# EAGLE design Custom_Teensy_3.1 (EAGLE 7.6.0)
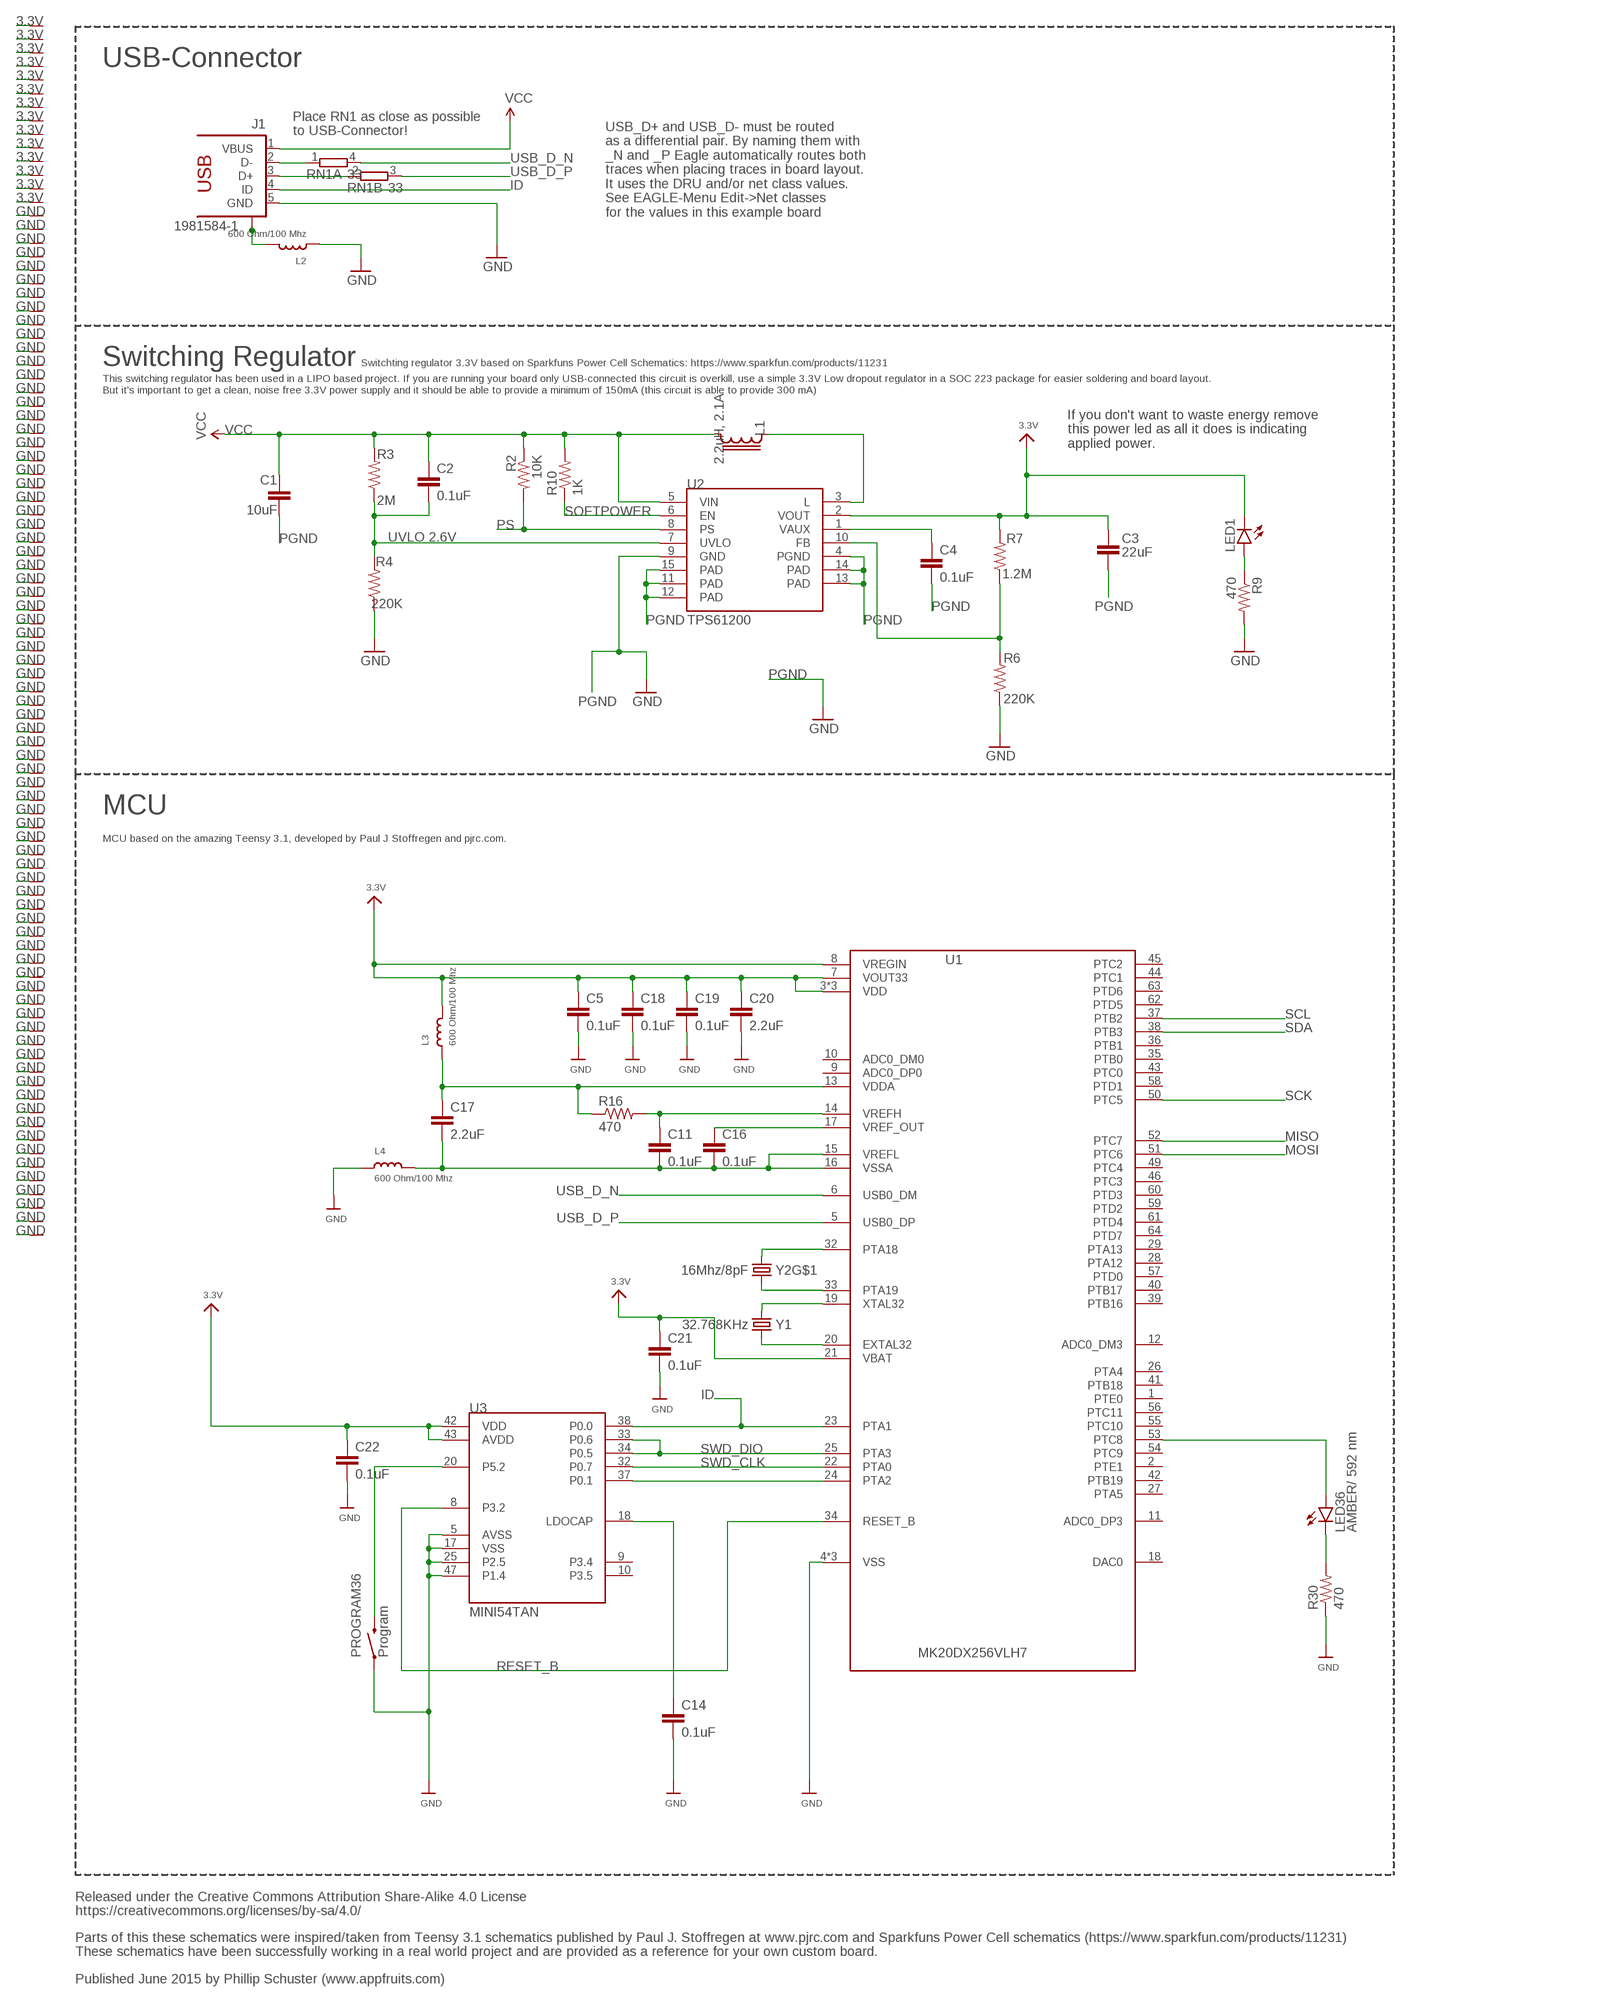
[diagram p0: schematic, sheet 1]

## Parts
C1  10uF  CAPACITOR-10UF  [0603-CAP]
C2  0.1uF  CAPACITOR-0.1UF  [0603-CAP]
C3  22uF  CAPACITOR-22UF  [0603-CAP]
C4  0.1uF  CAPACITOR-0.1UF  [0603-CAP]
C5  0.1uF  CAPACITOR-0.1UF  [0603-CAP]
C11  0.1uF  CAPACITOR-0.1UF  [0603-CAP]
C14  0.1uF  CAPACITOR-0.1UF  [0603-CAP]
C16  0.1uF  CAPACITOR-0.1UF  [0603-CAP]
C17  2.2uF  CAPACITOR-2.2UF  [0603-CAP]
C18  0.1uF  CAPACITOR-0.1UF  [0603-CAP]
C19  0.1uF  CAPACITOR-0.1UF  [0603-CAP]
C20  2.2uF  CAPACITOR-2.2UF  [0603-CAP]
C21  0.1uF  CAPACITOR-0.1UF  [0603-CAP]
C22  0.1uF  CAPACITOR-0.1UF  [0603-CAP]
J1  1981584-1  [1981584-1]
L1  2.2uH, 2.1A  LPS30152.2UH  [LPS3015]
L2  600 Ohm/100 Mhz  INDUCTOR-BK2125HM601-T  [0805]
L3  600 Ohm/100 Mhz  INDUCTOR-BK2125HM601-T  [0805]
L4  600 Ohm/100 Mhz  INDUCTOR-BK2125HM601-T  [0805]
LED1  LED-GREEN  [LED-0603]
LED36  AMBER/ 592 nm  LED-AMBER  [LED-0603]
PROGRAM36  Program  SWITCH-MOMENTARY-2-SMD-1101NE  [TACTILE-SWITCH-1101NE]
R2  10K  RESISTOR-10K  [0603-RES]
R3  2M  RESISTOR-2M  [0603-RES]
R4  220K  RESISTOR-220K  [0603-RES]
R6  220K  RESISTOR-220K  [0603-RES]
R7  1.2M  RESISTOR-1.2M  [0603-RES]
R9  470  RESISTOR-470  [0603-RES]
R10  1K  RESISTOR-1K  [0603-RES]
R16  470  RESISTOR-470  [0603-RES]
R30  470  RESISTOR-470  [0603-RES]
RN1  33  2R-NEXB34V  [EXB34V]
U1  MK20DX256VLH7  [MK20DX256VLH7]
U2  TPS61200  [QFN-10_PAD]
U3  MINI54TAN  [MINI54TAN]
VP_0  VPDEV0  [VPAC0]
VP_1  VPDEV0  [VPAC0]
VP_2  VPDEV0  [VPAC0]
VP_3  VPDEV0  [VPAC0]
VP_4  VPDEV0  [VPAC0]
VP_5  VPDEV0  [VPAC0]
VP_6  VPDEV0  [VPAC0]
VP_7  VPDEV0  [VPAC0]
VP_8  VPDEV0  [VPAC0]
VP_9  VPDEV0  [VPAC0]
VP_10  VPDEV0  [VPAC0]
VP_11  VPDEV0  [VPAC0]
VP_12  VPDEV0  [VPAC0]
VP_13  VPDEV0  [VPAC0]
VP_14  VPDEV1  [VPAC1]
VP_15  VPDEV1  [VPAC1]
VP_16  VPDEV1  [VPAC1]
VP_17  VPDEV2  [VPAC2]
VP_18  VPDEV3  [VPAC3]
VP_19  VPDEV3  [VPAC3]
VP_20  VPDEV3  [VPAC3]
VP_21  VPDEV3  [VPAC3]
VP_22  VPDEV3  [VPAC3]
VP_23  VPDEV0  [VPAC0]
VP_24  VPDEV0  [VPAC0]
VP_25  VPDEV0  [VPAC0]
VP_26  VPDEV0  [VPAC0]
VP_27  VPDEV0  [VPAC0]
VP_28  VPDEV0  [VPAC0]
VP_29  VPDEV0  [VPAC0]
VP_30  VPDEV0  [VPAC0]
VP_31  VPDEV0  [VPAC0]
VP_32  VPDEV0  [VPAC0]
VP_33  VPDEV0  [VPAC0]
VP_34  VPDEV0  [VPAC0]
VP_35  VPDEV0  [VPAC0]
VP_36  VPDEV0  [VPAC0]
VP_37  VPDEV0  [VPAC0]
VP_38  VPDEV0  [VPAC0]
VP_39  VPDEV0  [VPAC0]
VP_40  VPDEV0  [VPAC0]
VP_41  VPDEV0  [VPAC0]
VP_42  VPDEV0  [VPAC0]
VP_43  VPDEV0  [VPAC0]
VP_44  VPDEV0  [VPAC0]
VP_45  VPDEV0  [VPAC0]
VP_46  VPDEV0  [VPAC0]
VP_47  VPDEV0  [VPAC0]
VP_48  VPDEV0  [VPAC0]
VP_49  VPDEV0  [VPAC0]
VP_50  VPDEV0  [VPAC0]
VP_51  VPDEV0  [VPAC0]
VP_52  VPDEV0  [VPAC0]
VP_53  VPDEV0  [VPAC0]
VP_54  VPDEV0  [VPAC0]
VP_55  VPDEV0  [VPAC0]
VP_56  VPDEV0  [VPAC0]
VP_57  VPDEV0  [VPAC0]
VP_58  VPDEV0  [VPAC0]
VP_59  VPDEV0  [VPAC0]
VP_60  VPDEV0  [VPAC0]
VP_61  VPDEV0  [VPAC0]
VP_62  VPDEV0  [VPAC0]
VP_63  VPDEV0  [VPAC0]
VP_64  VPDEV0  [VPAC0]
VP_65  VPDEV0  [VPAC0]
VP_66  VPDEV0  [VPAC0]
VP_67  VPDEV0  [VPAC0]
VP_68  VPDEV0  [VPAC0]
VP_69  VPDEV0  [VPAC0]
VP_70  VPDEV0  [VPAC0]
VP_71  VPDEV0  [VPAC0]
VP_72  VPDEV0  [VPAC0]
VP_73  VPDEV0  [VPAC0]
VP_74  VPDEV0  [VPAC0]
VP_75  VPDEV0  [VPAC0]
VP_76  VPDEV0  [VPAC0]
VP_77  VPDEV0  [VPAC0]
VP_78  VPDEV0  [VPAC0]
VP_79  VPDEV0  [VPAC0]
VP_80  VPDEV0  [VPAC0]
VP_81  VPDEV0  [VPAC0]
VP_82  VPDEV0  [VPAC0]
VP_83  VPDEV0  [VPAC0]
VP_84  VPDEV0  [VPAC0]
VP_85  VPDEV0  [VPAC0]
VP_86  VPDEV0  [VPAC0]
VP_87  VPDEV0  [VPAC0]
VP_88  VPDEV0  [VPAC0]
VP_89  VPDEV0  [VPAC0]
Y1  32.768KHz  CRYSTAL/32.768KHZ/SMD-TXC_7A  [CRYSTAL-TXC-7A]
Y2  16Mhz/8pF  CRYSTAL/SMD-5X3-GND16MHZ/8PF  [CRYSTAL-SMD-5X3]

## Nets
3.3V: C3.1 C5.1 C18.1 C19.1 C20.1 C21.1 C22.1 L3.2 LED1.C R7.2 U1.3(VDD) U1.7(VOUT33) U1.8(VREGIN) U1.21(VBAT) U1.30(VDD) U1.48(VDD) U2.2(VOUT) U3.42(VDD) U3.43(AVDD) VP_0.VP VP_1.VP VP_2.VP VP_3.VP VP_4.VP VP_5.VP VP_6.VP VP_7.VP VP_8.VP VP_9.VP VP_10.VP VP_11.VP VP_12.VP VP_13.VP
FB: R6.2 R7.1 U2.10(FB)
GND [Top GND Pour]: C5.2 C14.2 C18.2 C19.2 C20.2 C21.2 C22.2 J1.5(GND) L2.1 L4.1 PROGRAM36.P$1 R4.1 R6.1 R9.2 R30.1 U1.4(VSS) U1.31(VSS) U1.47(VSS) U3.5(AVSS) U3.17(VSS) U3.25(P2.5) U3.47(P1.4) VP_14.VP VP_15.VP VP_16.VP VP_17.VP VP_18.VP VP_19.VP VP_20.VP VP_21.VP VP_22.VP VP_23.VP VP_24.VP VP_25.VP VP_26.VP VP_27.VP VP_28.VP VP_29.VP VP_30.VP VP_31.VP VP_32.VP VP_33.VP VP_34.VP VP_35.VP VP_36.VP VP_37.VP VP_38.VP VP_39.VP VP_40.VP VP_41.VP VP_42.VP VP_43.VP VP_44.VP VP_45.VP VP_46.VP VP_47.VP VP_48.VP VP_49.VP VP_50.VP VP_51.VP VP_52.VP VP_53.VP VP_54.VP VP_55.VP VP_56.VP VP_57.VP VP_58.VP VP_59.VP VP_60.VP VP_61.VP VP_62.VP VP_63.VP VP_64.VP VP_65.VP VP_66.VP VP_67.VP VP_68.VP VP_69.VP VP_70.VP VP_71.VP VP_72.VP VP_73.VP VP_74.VP VP_75.VP VP_76.VP VP_77.VP VP_78.VP VP_79.VP VP_80.VP VP_81.VP VP_82.VP VP_83.VP VP_84.VP VP_85.VP VP_86.VP VP_87.VP VP_88.VP VP_89.VP
ID: J1.4(ID) U1.23(PTA1) U3.38(P0.0)
MISO: U1.52(PTC7)
MOSI: U1.51(PTC6)
N$1: LED1.A R9.1
N$2: L1.1 U2.3(L)
N$12: LED36.A U1.53(PTC8)
N$15: U1.24(PTA2) U3.37(P0.1)
N$18: LED36.C R30.2
N$19: PROGRAM36.P$2 U3.20(P5.2)
N$22: C14.1 U3.18(LDOCAP)
N$27: U1.32(PTA18) Y2.3
N$28: U1.33(PTA19) Y2.1
N$29: U1.19(XTAL32) Y1.P$2
N$30: U1.20(EXTAL32) Y1.P$1
PGND: C1.2 C3.2 C4.2 U2.4(PGND) U2.9(GND) U2.11(PAD) U2.12(PAD) U2.13(PAD) U2.14(PAD) U2.15(PAD) ; supply symbol labelled GND
PS: R2.2 U2.8(PS)
RESET_B: U1.34(RESET_B) U3.8(P3.2)
SCK: U1.50(PTC5)
SCL: U1.37(PTB2)
SDA: U1.38(PTB3)
SOFTPOWER: R10.1 U2.6(EN)
SWD_CLK: U1.22(PTA0) U3.32(P0.7)
SWD_DIO: U1.25(PTA3) U3.33(P0.6) U3.34(P0.5)
USB_CON_N [USB]: J1.2(D-) RN1.1
USB_CON_P [USB]: J1.3(D+) RN1.2
USB_D_N [USB]: RN1.4 U1.6(USB0_DM)
USB_D_P [USB]: RN1.3 U1.5(USB0_DP)
USB_SHIELD: J1.S1 J1.S2 J1.S3 J1.S4 L2.2
UVLO: C2.2 R3.1 R4.2 U2.7(UVLO)
VAUX: C4.1 U2.1(VAUX)
VCC: C1.1 C2.1 J1.1(VBUS) L1.2 R2.1 R3.2 R10.2 U2.5(VIN)
VDDA: C17.1 L3.1 R16.1 U1.13(VDDA)
VREF_OUT: C16.1 U1.17(VREF_OUT)
VREFH: C11.1 R16.2 U1.14(VREFH)
VREFL: C11.2 C16.2 C17.2 L4.2 U1.15(VREFL) U1.16(VSSA)
Unconnected: U1.1(PTE0) U1.2(PTE1) U1.9(ADC0_DP0) U1.10(ADC0_DM0) U1.11(ADC0_DP3) U1.12(ADC0_DM3) U1.18(DAC0) U1.26(PTA4) U1.27(PTA5) U1.28(PTA12) U1.29(PTA13) U1.35(PTB0) U1.36(PTB1) U1.39(PTB16) U1.40(PTB17) U1.41(PTB18) U1.42(PTB19) U1.43(PTC0) U1.44(PTC1) U1.45(PTC2) U1.46(PTC3) U1.49(PTC4) U1.54(PTC9) U1.55(PTC10) U1.56(PTC11) U1.57(PTD0) U1.58(PTD1) U1.59(PTD2) U1.60(PTD3) U1.61(PTD4) U1.62(PTD5) U1.63(PTD6) U1.64(PTD7) U3.9(P3.4) U3.10(P3.5) Y2.2(GND:GND) Y2.4(GND:GND)

## Notes on the sheet
- USB-Connector
- Place RN1 as close as possible
  to USB-Connector!
- USB_D+ and USB_D- must be routed
  as a differential pair. By naming them with
  _N and _P Eagle automatically routes both
  traces when placing traces in board layout.
  It uses the DRU and/or net class values. 
  See EAGLE-Menu Edit->Net classes 
  for the values in this example board
- Switching Regulator | Switchting regulator 3.3V based on Sparkfuns Power Cell Schematics: https://www.sparkfun.com/products/11231
- This switching regulator has been used in a LIPO based project. If you are running your board only USB-connected this circuit is overkill, use a simple 3.3V Low dropout regulator in a SOC 223 package for easier soldering and board layout.
  But it's important to get a clean, noise free 3.3V power supply and it should be able to provide a minimum of 150mA (this circuit is able to provide 300 mA)
- If you don't want to waste energy remove
  this power led as all it does is indicating
  applied power.
- UVLO 2.6V
- MCU
- MCU based on the amazing Teensy 3.1, developed by Paul J Stoffregen and pjrc.com.
- Released under the Creative Commons Attribution Share-Alike 4.0 License
  https://creativecommons.org/licenses/by-sa/4.0/
- Parts of this these schematics were inspired/taken from Teensy 3.1 schematics published by Paul J. Stoffregen at www.pjrc.com and Sparkfuns Power Cell schematics (https://www.sparkfun.com/products/11231)
  These schematics have been successfully working in a real world project and are provided as a reference for your own custom board.
- Published June 2015 by Phillip Schuster (www.appfruits.com)

## Library data of the parts
C1 = appfruits:CAPACITOR; MF: Murata; MPN: GRM188R60J106ME47D
C2 C4 C5 C11 C14 C16 C18 C19 C21 C22 = appfruits:CAPACITOR; MF: Kemet; MPN: C0603C104J3RACTU
C3 = appfruits:CAPACITOR; MF: Murata; MPN: GRM188R60J226MEA0D
C17 C20 = appfruits:CAPACITOR; MF: Kemet; MPN: C0603C225K4PACTU
J1 = con-usb:1981584-1: Receptacle, micro-USB, type A/B Tyco Electronics; MF: Hirose; MPN: ZX62-AB-5PA(11)
L1 = appfruits:LPS3015: Shielded Power Inductor; MF: Coilcraft; MPN: LPS3015-222MRB
L2-L4 = appfruits:INDUCTOR: Inductors 0603: 10nH Ceramic Inductor - microwire antenna/RF (Digikey: 712-1434-2-ND) 0805: 560nH Ceramic Inductor - RF (Digikey: 553-1047-1-ND) 270nH Ceramic Inductor - Q = 40@250MHz, +-5%, 1 Ohm DC Resistance (Digikey: 535-10506-2-ND) 1007 (2518 Metric) SMT: 10µH 10% 250mOhm 820mA 1007 Inductor (Digikey: 587-2189-1-ND) 22µH 10% 500mOhm 580mA 1007 Inductor (Digikey: 587-2190-1-ND) 47µH 10% 950mOhm 420mA 1007 Inductor (Digikey: 587-2191-1-ND) 47µH 5% 100mOhm 1A 1008 Inductor (Digikey: 732-1816-1-ND) 5.0x5.0mm (Taiyo Yuden NR5040 Series) 6.8µH 20% 2.3A 64mOhm Inductor (Digikey: 587-2374-2-ND) 5.0x5.0mm (TDK VLC5045 Series) 4.7µH 20% 3.3A 34mOhm Inductor (Digikey: 445-6526-1-ND) 6.8µH 20% 2.7A 46mOhm Inductor (Digikey: 445-6527-1-ND) 6.0x6.0mm (TDK VLC6045 Series) 4.7µH 20% 3.8A 27mOhm Inductor (Digikey: 445-6538-2-ND) 6.8µH 20% 3A 41mOhm Inductor (Digikey: 445-6540-1-ND) 6.2µH 30% 2.2A 45mOhm Inductor (Digikey: SRR5028-6R2YCT-ND) - Not TDK VLC6045 but footprint should match 6.0x6.0mm (TDK SLF6045 Series) 6.8uH 30% 2A 33mOhm Inductor (Digikey: 445-4572-1-ND, Mouser: 810-SLF645T6R8N2R0PF) 6.0x6.0mm (Sumida CDRH5D28 Series) 6.2uH 30% 1.8A 45mOhm Inductor (Digikey: 308-1542-1-ND) Taiyo Yuden NR3015T2R2M - 2.2uH 20% 1.5A (Digikey: 587-1648-2-ND, Mouser: 963-NR3015T2R2M) - Used with TI TPS62172 CoilCraft RFID Transponder Coil - MA5532-AE (For use with AS3935 Lightning Sensor); MF: Taiyo Yuden; MPN: BK2125HM601-T
LED1 = appfruits:LED: LEDs Standard schematic elements and footprints for 5mm, 3mm, 1206, and 0603 sized LEDs. 5mm - Spark Fun Electronics SKU : COM-00529 (and others); MF: Avago; MPN: HSMG-C190
LED36 = appfruits:LED: LEDs Standard schematic elements and footprints for 5mm, 3mm, 1206, and 0603 sized LEDs. 5mm - Spark Fun Electronics SKU : COM-00529 (and others); MF: Avago Technologies; MPN: HSMA-C190
PROGRAM36 = SparkFun-Electromechanical:SWITCH-MOMENTARY-2: Various NO switches- pushbuttons, reed, etc; MF: C&K Components; MPN: RS-282G05A3-SM RT
R2 = appfruits:RESISTOR: Resistor Basic schematic elements and footprints for 0603, 1206, and PTH resistors.; MF: Panasonic; MPN: ERJ-3GEYJ103V
R3 = appfruits:RESISTOR: Resistor Basic schematic elements and footprints for 0603, 1206, and PTH resistors.; MF: Panasonic; MPN: ERJ-3GEYJ205V
R4 R6 = appfruits:RESISTOR: Resistor Basic schematic elements and footprints for 0603, 1206, and PTH resistors.; MF: Panasonic; MPN: ERJ-3GEYJ224V
R7 = appfruits:RESISTOR: Resistor Basic schematic elements and footprints for 0603, 1206, and PTH resistors.; MF: Panasonic; MPN: ERJ-3GEYJ125V
R9 R16 R30 = appfruits:RESISTOR: Resistor Basic schematic elements and footprints for 0603, 1206, and PTH resistors.; MF: Panasonic; MPN: ERJ-3GEYJ471V
R10 = appfruits:RESISTOR: Resistor Basic schematic elements and footprints for 0603, 1206, and PTH resistors.; MF: Panasonic; MPN: ERJ-3GEYJ102V
RN1 = resistor-dil:2R-N: Array Chip Resistor Source: Panasonic; MF: Panasonic; MPN: EXB-34V330JV; OC_FARNELL: unknown; OC_NEWARK: unknown
U1 = appfruits:MK20DX256VLH7; MF: Freescale; MPN: MK20DX256VLH7
U2 = appfruits:TPS61200: DC to DC Booster IC-10035; MF: Texas Instruments; MPN: TPS61200DRCR; PROD_ID: IC-10035
U3 = TeensyCustom:MINI54TAN: MINI54TAN Bootloader from PJRC.com, preprogrammed with Teensy 3.0 bootloader. https://www.pjrc.com/store/ic_mini54_tqfp.html
VP_0 VP_1-VP_13 VP_23-VP_89 = vpad:VPDEV0: VIAPAD
VP_14-VP_16 = vpad:VPDEV1: VIAPAD
VP_17 = vpad:VPDEV2: VIAPAD
VP_18-VP_22 = vpad:VPDEV3: VIAPAD
Y1 = appfruits:CRYSTAL/32.768KHZ/SMD-TXC_7A; MF: Epson Timing; MPN: FC-255 32.7680K-A3
Y2 = appfruits:CRYSTAL/SMD-5X3-GND; MF: ECS; MPN: ECS-160-8-30B-CKM

## Net classes
1 USB: width 0.254 mm, drill 0.33 mm, clearance 0.159 mm
2 Top GND Pour: clearance 0.762 mm to class 1

## Board
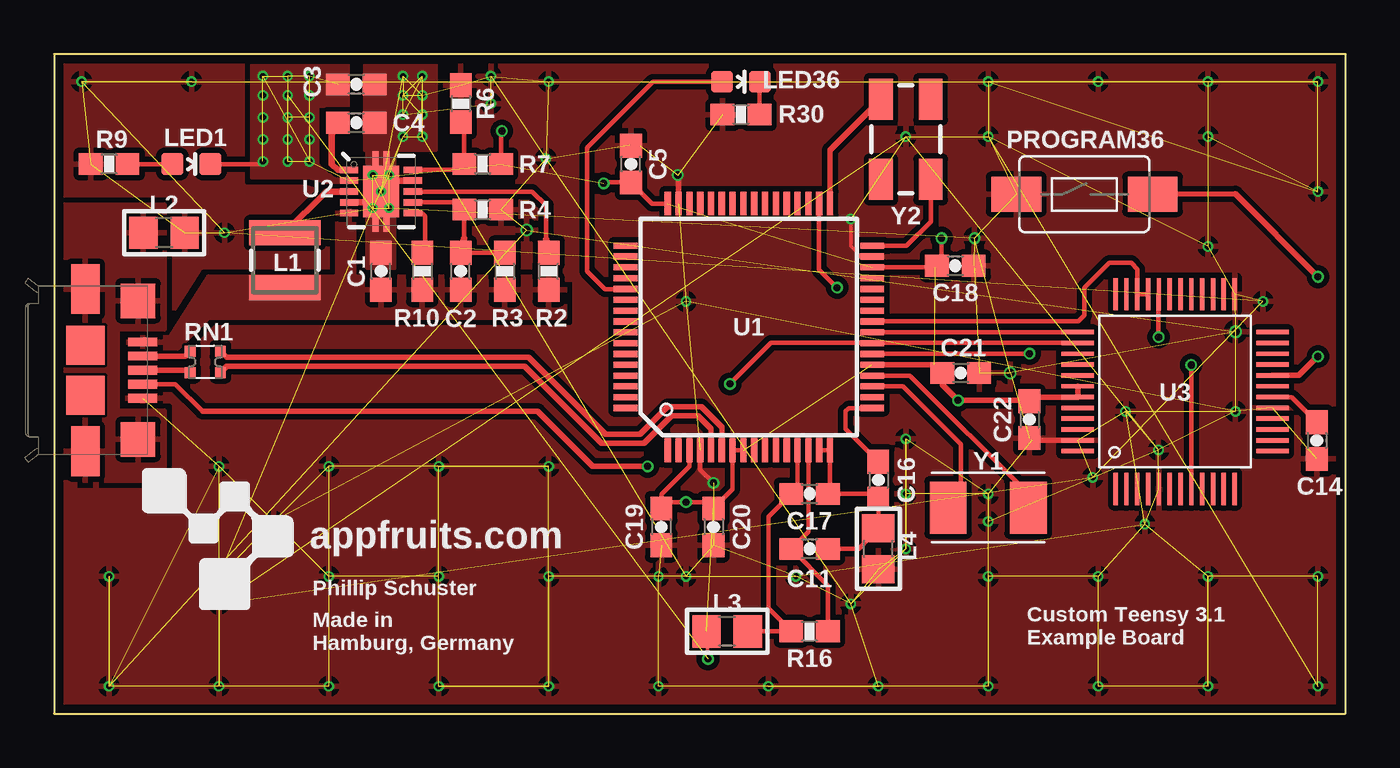
[diagram p1: board, top side]
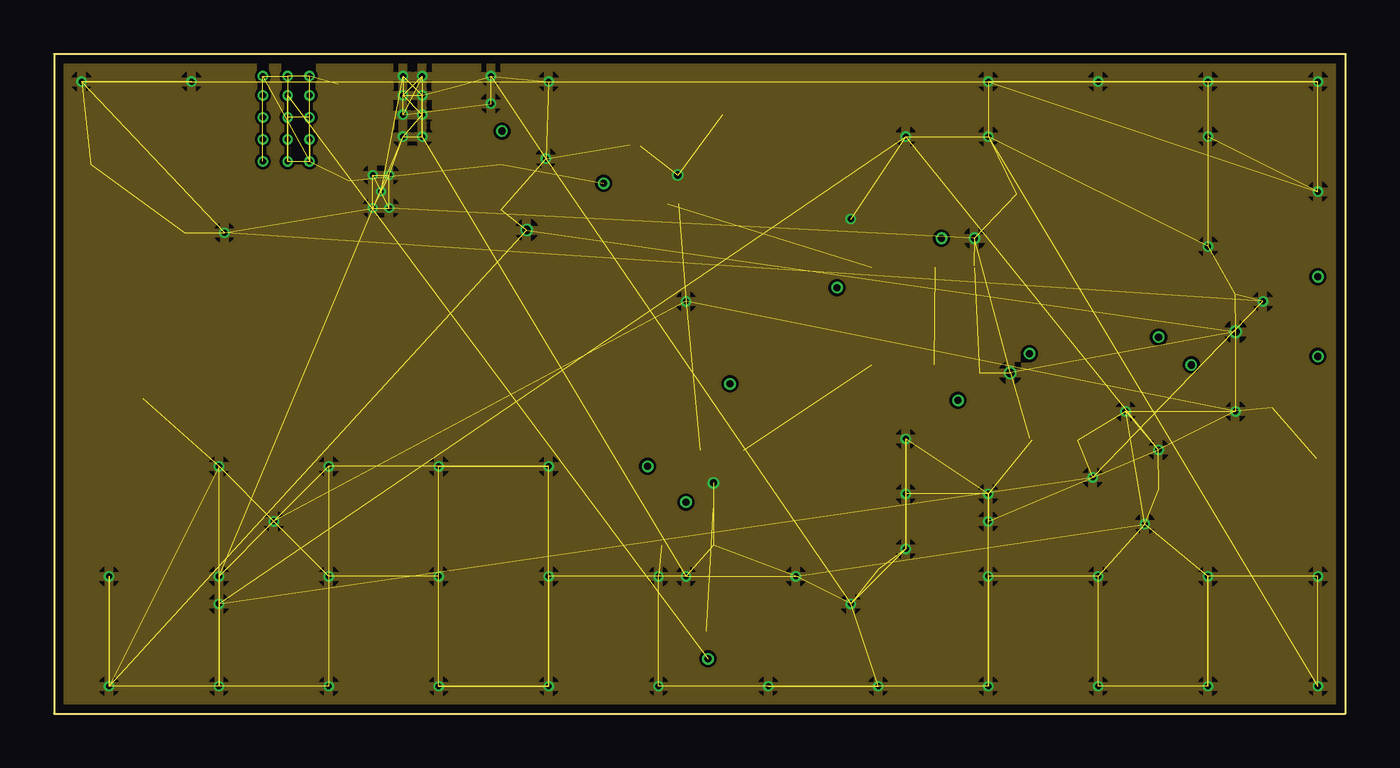
[diagram p2: board, inner layer GND]
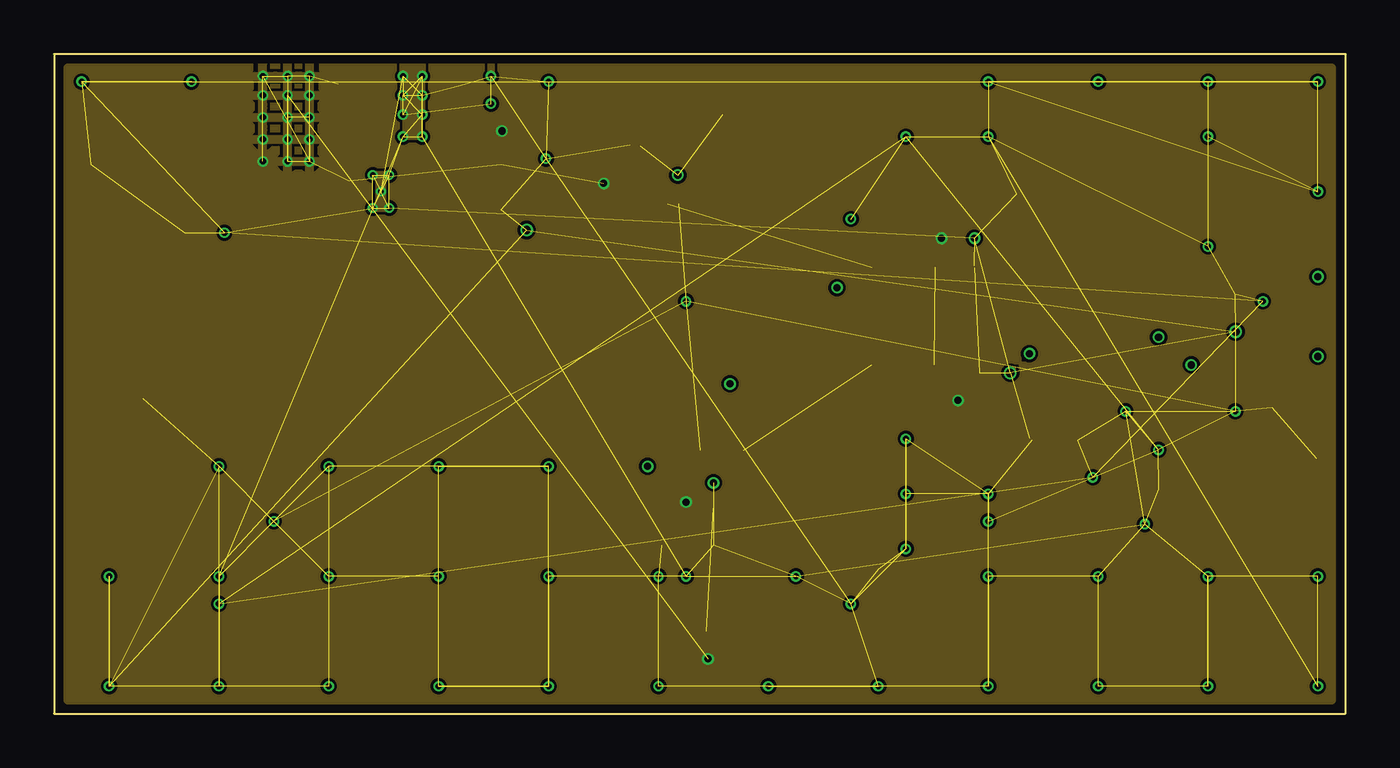
[diagram p3: board, inner layer 3V3]
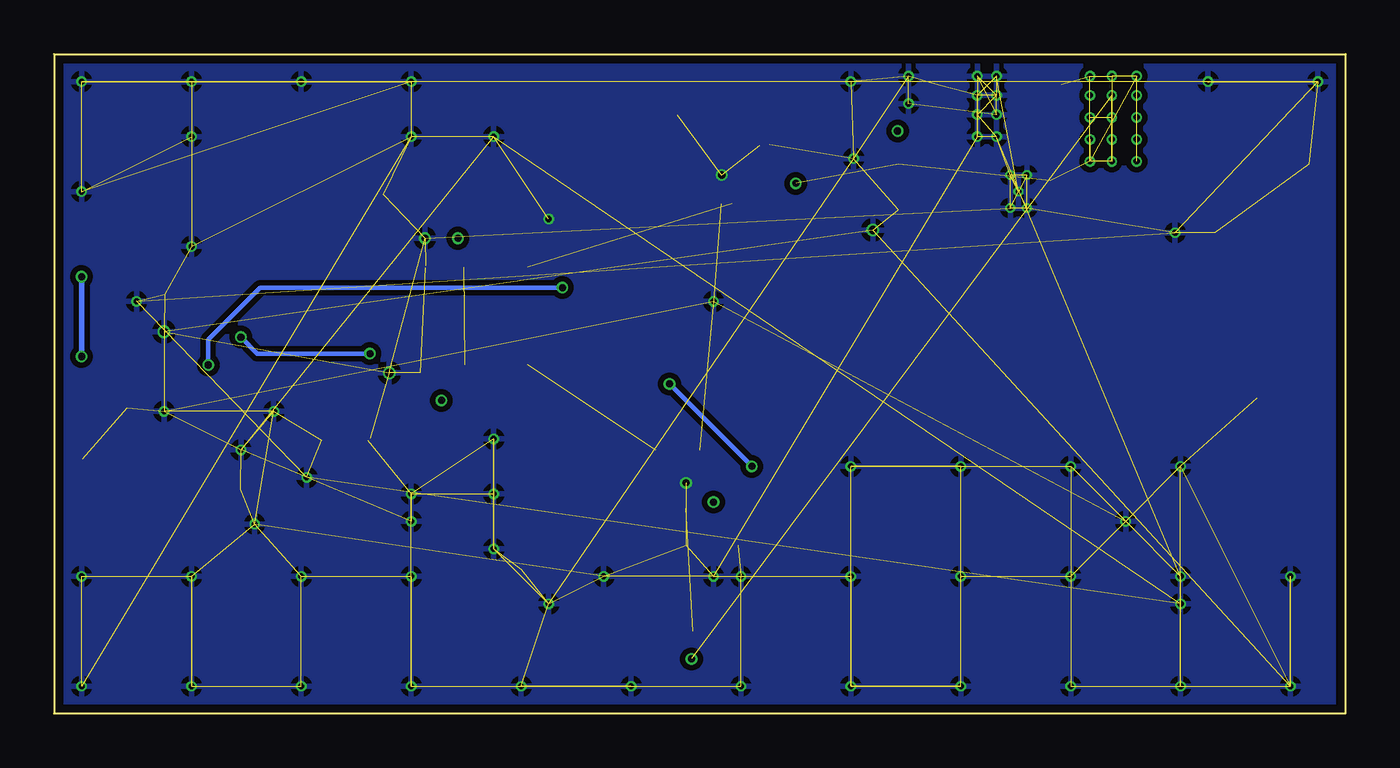
[diagram p4: board, bottom side, seen from below]

Size 59.69 x 30.48 mm. Coordinates in mm from the lower left corner, seen from the top.
Outline: 0,0 59.69,0 59.69,30.48 0,30.48 0,0
Copper layers (1*2*15*16): Top 0.035559375mm / dielectric 0.17018125mm / GND 0.01778125mm / dielectric 47mil / 3V3 0.01778125mm / dielectric 0.17018125mm / Bottom 0.035559375mm
Design rules "OSHPark-4layer *": minimum track width 5mil, minimum drill 10mil, track to track 5mil, track to pad 5mil, pad to pad 5mil, via to via 5mil, smd to smd 5mil, copper to edge 15mil, drill to drill 6mil, minimum pad ring 4mil, minimum via ring 4mil, stop-mask expansion 4mil, vias tented up to drill 12mil, thermal gap 10mil

### Footprints (pad centres in the part's own frame; a part is rotated, then mirrored left to right if it is on the bottom)
0603-CAP = smd 1.1 x 1: 1 -0.85,0; 2 0.85,0
1981584-1 = smd 0.4 x 1.35: 1 -1.3,4.1; 2 -0.65,4.1; 3 0,4.1; 4 0.65,4.1; 5 1.3,4.1 | smd 1.8 x 1.8: M1 -1.15,1.45; M2 1.15,1.45 | smd 2.3 x 1.3: S1 -3.75,1.45; S2 3.75,1.45 | smd 1.6 x 1.6: S3 -3.2,3.885; S4 3.2,3.885
LPS3015 = smd 1.14 x 3.3: 1 -1.27,0; 2 1.27,0
0805 = smd 1.3 x 1.5: 1 -0.95,0; 2 0.95,0
LED-0603 = smd 1 x 1: A 0,-0.877; C 0,0.877
TACTILE-SWITCH-1101NE = smd 2.3 x 1.6: P$1 -3.15,0; P$2 3.15,0
0603-RES = smd 1.1 x 1: 1 -0.85,0; 2 0.85,0
EXB34V = smd 0.5 x 0.5: 1 -0.5,-0.7; 2 0.5,-0.7; 3 0.5,0.7; 4 -0.5,0.7
MK20DX256VLH7 = smd 1.1 x 0.285: 1 -5.7,3.75; 2 -5.7,3.25; 3 -5.7,2.75; 4 -5.7,2.25; 5 -5.7,1.75; 6 -5.7,1.25; 7 -5.7,0.75; 8 -5.7,0.25; 9 -5.7,-0.25; 10 -5.7,-0.75; 11 -5.7,-1.25; 12 -5.7,-1.75; 13 -5.7,-2.25; 14 -5.7,-2.75; 15 -5.7,-3.25; 16 -5.7,-3.75; 33 5.7,-3.75; 34 5.7,-3.25; 35 5.7,-2.75; 36 5.7,-2.25; 37 5.7,-1.75; 38 5.7,-1.25; 39 5.7,-0.75; 40 5.7,-0.25; 41 5.7,0.25; 42 5.7,0.75; 43 5.7,1.25; 44 5.7,1.75; 45 5.7,2.25; 46 5.7,2.75; 47 5.7,3.25; 48 5.7,3.75 | smd 0.285 x 1.1: 17 -3.75,-5.7; 18 -3.25,-5.7; 19 -2.75,-5.7; 20 -2.25,-5.7; 21 -1.75,-5.7; 22 -1.25,-5.7; 23 -0.75,-5.7; 24 -0.25,-5.7; 25 0.25,-5.7; 26 0.75,-5.7; 27 1.25,-5.7; 28 1.75,-5.7; 29 2.25,-5.7; 30 2.75,-5.7; 31 3.25,-5.7; 32 3.75,-5.7; 49 3.75,5.7; 50 3.25,5.7; 51 2.75,5.7; 52 2.25,5.7; 53 1.75,5.7; 54 1.25,5.7; 55 0.75,5.7; 56 0.25,5.7; 57 -0.25,5.7; 58 -0.75,5.7; 59 -1.25,5.7; 60 -1.75,5.7; 61 -2.25,5.7; 62 -2.75,5.7; 63 -3.25,5.7; 64 -3.75,5.7
QFN-10_PAD = smd 0.297 x 0.85: 1 -1,-1.475; 2 -0.5,-1.475; 3 0,-1.475; 4 0.5,-1.475; 5 1,-1.475; 6 1,1.475; 7 0.5,1.475; 8 0,1.475; 9 -0.5,1.475; 10 -1,1.475 | smd 0.7 x 0.28: 11 -1.5,0.25; 12 -1.5,-0.25; 13 1.5,0.25; 14 1.5,-0.25 | smd 2.4 x 1.65: 15 0,0
MINI54TAN = smd 0.203 x 1.5: 1 -2.75,-4.5; 2 -2.25,-4.5; 3 -1.75,-4.5; 4 -1.25,-4.5; 5 -0.75,-4.5; 6 -0.25,-4.5; 7 0.25,-4.5; 8 0.75,-4.5; 9 1.25,-4.5; 10 1.75,-4.5; 11 2.25,-4.5; 12 2.75,-4.5; 25 2.75,4.5; 26 2.25,4.5; 27 1.75,4.5; 28 1.25,4.5; 29 0.75,4.5; 30 0.25,4.5; 31 -0.25,4.5; 32 -0.75,4.5; 33 -1.25,4.5; 34 -1.75,4.5; 35 -2.25,4.5; 36 -2.75,4.5 | smd 1.5 x 0.203: 13 4.5,-2.75; 14 4.5,-2.25; 15 4.5,-1.75; 16 4.5,-1.25; 17 4.5,-0.75; 18 4.5,-0.25; 19 4.5,0.25; 20 4.5,0.75; 21 4.5,1.25; 22 4.5,1.75; 23 4.5,2.25; 24 4.5,2.75; 37 -4.5,2.75; 38 -4.5,2.25; 39 -4.5,1.75; 40 -4.5,1.25; 41 -4.5,0.75; 42 -4.5,0.25; 43 -4.5,-0.25; 44 -4.5,-0.75; 45 -4.5,-1.25; 46 -4.5,-1.75; 47 -4.5,-2.25; 48 -4.5,-2.75
VPAC0 = drill 0.279 pad 0.483: VP 0,0
VPAC1 = drill 0.381 pad 0.584: VP 0,0
VPAC2 = drill 0.33 pad 0.533: VP 0,0
VPAC3 = drill 0.254 pad 0.457: VP 0,0
CRYSTAL-TXC-7A = smd 1.7 x 2.4: P$1 1.85,0; P$2 -1.85,0
CRYSTAL-SMD-5X3 = smd 1.9 x 1.1: 1 -1.85,-1.15; 2 1.85,-1.15; 3 1.85,1.15; 4 -1.85,1.15

### Placement (x,y rotation side)
C1  15.11,20.45 90 top
C2  18.8,20.45 90 top
C3  13.97,29.08 0 top
C4  13.97,27.3 0 top
C5  26.67,25.4 90 top
C11  34.92,7.62 0 top
C14  58.37,12.62 270 top
C16  38.1,10.79 270 top
C17  34.92,10.16 0 top
C18  41.66,20.7 0 top
C19  28.07,8.64 270 top
C20  30.48,8.64 270 top
C21  41.91,15.75 0 top
C22  45.09,13.59 270 top
J1  0,15.88 270 top
L1  10.67,20.95 270 top
L2  5.08,22.23 180 top
L3  31.11,3.81 180 top
L4  38.1,7.62 90 top
LED1  6.35,25.4 270 top
LED36  31.75,29.21 270 top
PROGRAM36  47.62,24 0 top
R2  22.86,20.45 90 top
R3  20.83,20.45 270 top
R4  19.81,23.29 180 top
R6  18.8,28.19 270 top
R7  19.81,25.4 0 top
R9  2.54,25.4 180 top
R10  17.02,20.45 270 top
R16  34.92,3.81 0 top
R30  31.75,27.69 0 top
RN1  6.99,16.26 270 top
U1  32.12,17.88 90 top
U2  15.11,24.13 270 top
U3  51.82,14.88 0 top
VP_0  10.79,28.57 0 top
VP_1  10.79,27.56 0 top
VP_2  10.79,26.54 0 top
VP_3  10.79,25.53 0 top
VP_4  10.79,29.46 0 top
VP_5  11.81,29.46 0 top
VP_6  11.81,28.57 0 top
VP_7  11.81,27.56 0 top
VP_8  11.81,26.54 0 top
VP_9  11.81,25.53 0 top
VP_10  9.65,29.46 0 top
VP_11  9.65,28.57 0 top
VP_12  9.65,27.56 0 top
VP_13  9.65,26.54 0 top
VP_14  21.84,22.35 0 top
VP_15  54.61,17.65 0 top
VP_16  44.2,15.75 0 top
VP_17  42.55,21.97 0 top
VP_18  15.49,23.37 0 top
VP_19  15.49,24.89 0 top
VP_20  14.73,23.37 0 top
VP_21  14.73,24.89 0 top
VP_22  15.11,24.13 0 top
VP_23  16.13,29.46 0 top
VP_24  17.02,28.57 0 top
VP_25  17.02,26.67 0 top
VP_26  29.21,6.35 0 top
VP_27  34.29,6.35 0 top
VP_28  50.42,8.76 0 top
VP_29  49.53,13.97 0 top
VP_30  54.61,13.97 0 top
VP_31  29.21,19.05 0 top
VP_32  10.16,8.89 0 top
VP_33  7.62,6.35 0 top
VP_34  16.13,26.67 0 top
VP_35  17.02,27.69 0 top
VP_36  16.13,28.57 0 top
VP_37  17.02,29.46 0 top
VP_38  16.13,27.69 0 top
VP_39  20.19,28.19 0 top
VP_40  20.19,29.46 0 top
VP_41  22.73,25.65 0 top
VP_42  36.83,5.08 0 top
VP_43  39.37,7.62 0 top
VP_44  39.37,10.16 0 top
VP_45  39.37,12.7 0 top
VP_46  43.18,10.16 0 top
VP_47  43.18,8.89 0 top
VP_48  51.05,12.19 0 top
VP_49  39.37,26.67 0 top
VP_50  7.62,5.08 0 top
VP_51  48.01,10.92 0 top
VP_52  55.88,19.05 0 top
VP_53  7.87,22.23 0 top
VP_54  1.27,29.21 0 top
VP_55  6.35,29.21 0 top
VP_56  22.86,29.21 0 top
VP_57  58.42,29.21 0 top
VP_58  53.34,29.21 0 top
VP_59  48.26,29.21 0 top
VP_60  43.18,29.21 0 top
VP_61  58.42,24.13 0 top
VP_62  53.34,26.67 0 top
VP_63  53.34,21.59 0 top
VP_64  43.18,26.67 0 top
VP_65  58.42,1.27 0 top
VP_66  58.42,6.35 0 top
VP_67  53.34,6.35 0 top
VP_68  53.34,1.27 0 top
VP_69  48.26,1.27 0 top
VP_70  48.26,6.35 0 top
VP_71  43.18,6.35 0 top
VP_72  43.18,1.27 0 top
VP_73  38.1,1.27 0 top
VP_74  33.02,1.27 0 top
VP_75  27.94,1.27 0 top
VP_76  27.94,6.35 0 top
VP_77  22.86,6.35 0 top
VP_78  22.86,1.27 0 top
VP_79  17.78,1.27 0 top
VP_80  17.78,6.35 0 top
VP_81  17.78,11.43 0 top
VP_82  22.86,11.43 0 top
VP_83  12.7,11.43 0 top
VP_84  12.7,6.35 0 top
VP_85  12.7,1.27 0 top
VP_86  7.62,1.27 0 top
VP_87  7.62,11.43 0 top
VP_88  2.54,1.27 0 top
VP_89  2.54,6.35 0 top
Y1  43.18,9.53 0 top
Y2  39.37,26.54 270 top

### Tracks (layer width: path | path; a pad name or v marks a point on that pad's centre or on a via)
3.3V  (via drill 0.28, 0.33)  (50 unrouted)
  Top 0.152: L3.2 30.21,2.55 v30.23,2.54 | 28.36,9.78 C19.1 | 30.19,9.78 C20.1
  Top 0.203: U1.48 27.64,23.57 C5.1 25.44,24.55 v25.4,24.51 | v41.02,21.97 41.02,20.79 C18.1 40.73,20.62 U1.30 | C20.1 31.36,10.37 U1.7 U1.8 | R7.2 20.66,26.89 v20.7,26.92 | 28.36,9.78 v29.21,9.78 30.19,9.78 | C19.1 28.07,10.13 29.36,11.43 U1.3 | LED1.C 9.53,25.4 v9.65,25.53
  Top 0.254: U1.21 40.68,16.12 C21.1 41.06,15.2 v41.78,14.48 45.05,14.48 C22.1 45.28,14.63 U3.43 U3.42
  pour 3V3: 0.64,0.64 59.05,0.64 59.05,29.84 0.64,29.84
  pour Top (isolate 0.203, no thermals): 13.84,24.38 13.21,24.38 11.81,24.77 9.14,24.77 9.14,29.97 13.59,29.97 13.59,28.07 12.19,28.07 12.19,25.4 12.7,24.89 13.84,24.89
FB
  Top 0.203: U2.10 18.69,25.13 R7.1 18.96,27.18 R6.2
GND  (via drill 0.28, 0.33)  (248 unrouted)
  Top 0.152: U1.31 37.3,21.12 36.83,21.59 v36.83,22.86
  Top 0.203: 27.09,26.25 C5.2 26.63,26.29 | 45.11,12.71 C22.2 45.19,12.63 | C18.2 42.55,20.61 | U1.4 29.86,11.28 v30.48,10.67
  Top 0.254: U3.47 45.19,12.63 | U1.47 28.86,24.86 v28.83,24.89
  pour Top (isolate 0.254, rank 3): 0,0 0,30.48 59.69,30.48 59.69,0
  pour Bottom (isolate 0.254): 0,30.48 59.69,30.48 59.69,0 0,0
  pour GND: 0,0 59.69,0 59.69,30.48 0,30.48
  pour 3V3 (rank 2, no thermals): 0,0 59.69,0 59.69,30.48 0,30.48
  pour Top (isolate 0.254, no thermals): 17.65,29.97 14.48,29.97 14.48,21.59 15.75,21.59 15.75,26.04 17.65,26.04
ID  (via drill 0.33)
  Top 0.203: U3.38 37.81,17.13 U1.23 37.8,17.14 33.15,17.14 v31.24,15.24 | J1.4 5.6,15.22 6.86,13.97
  Top 0.254: 6.86,13.97 22.35,13.97 24.89,11.43 v27.43,11.43
  Bottom 0.203: v27.43,11.43 v31.24,15.24
N$1
  Top 0.203: LED1.A R9.1
N$2
  Top 0.305: U2.3 12.57,24.13 L1.1
N$12
  Top 0.203: U1.53 25.46,19.62 24.64,20.45 24.64,26.16 27.69,29.21 LED36.A
N$15
  Top 0.203: U3.37 37.81,17.63 U1.24
N$18
  Top 0.203: LED36.C 32.6,29.21 R30.2
N$19  (via drill 0.33)
  Top 0.254: U3.20 57.54,15.63 v58.42,16.51 | v58.42,20.19 54.61,24.03 PROGRAM36.P$2
  Bottom 0.254: v58.42,16.51 v58.42,20.19
N$22
  Top 0.203: U3.18 57.21,14.63 C14.1
N$27
  Top 0.203: Y2.3 40.52,22.74 39.41,21.62 U1.32
N$28
  Top 0.254: U1.33 35.87,26.04 Y2.1
N$29
  Top 0.203: U1.19 39.23,15.12 41.91,12.45 41.91,9.53 Y1.P$2
N$30
  Top 0.203: U1.20 39.56,15.62 45.03,10.16 Y1.P$1
PGND
  Top 0.305: U2.4 14.48,23.63 14.48,23.5 15.11,23.5 U2.15 15.75,24.77 15.88,24.63 U2.9
  pour Top (no thermals): 17.65,29.97 14.35,29.97 14.35,26.04 14.48,26.04 14.48,20.57 15.75,20.57 15.75,26.04 17.65,26.04
PS
  Top 0.203: U2.8 22.1,24.13 22.73,23.5 22.73,21.93
  Top 0.305: 22.73,21.93 R2.2
RESET_B  (via drill 0.33)
  Top 0.203: U3.8 v52.57,16.12 | v36.2,19.68 35.37,20.52 U1.34
  Bottom 0.203: v52.57,16.12 52.57,17.28 50.16,19.68 v36.2,19.68
SOFTPOWER
  Top 0.203: U2.6 17,23.13 17.14,22.99 17.14,21.42 R10.1
SWD_CLK  (via drill 0.33)
  Top 0.203: U1.22 45.07,16.62 v45.09,16.64 | v51.05,17.4 51.05,19.37 U3.32
  Bottom 0.203: v45.09,16.64 50.29,16.64 v51.05,17.4
SWD_DIO
  Top 0.203: U3.33 U3.34 | U1.25 45.72,18.12 | 45.71,18.14 45.72,18.12 | 45.72,18.12 47.34,18.12 47.62,18.41 47.62,19.68 48.77,20.83 49.78,20.83 50.07,20.55 U3.34 | U3.34
USB_CON_N
  Top 0.254: RN1.1 6.05,16.52 J1.2
USB_CON_P
  Top 0.254: RN1.2 6.17,15.88 J1.3
USB_D_N
  Top 0.254: RN1.4 7.98,16.46 21.93,16.46 25.48,12.91 27.09,12.91 28.36,14.18 29.93,14.18 30.86,13.24 U1.6
USB_D_P
  Top 0.254: RN1.3 7.98,16.05 21.76,16.05 25.32,12.49 27.26,12.49 28.53,13.76 29.76,13.76 30.36,13.16 U1.5
USB_SHIELD
  pour Top: 0,10.79 0,23.5 5.08,23.5 5.08,17.78 2.92,17.78 2.92,13.97 5.08,13.97 5.08,10.79
UVLO
  Top 0.203: U2.7 18.7,23.63 | R4.2 18.96,21.97 | C2.2 R3.1
  Top 0.305: 18.7,23.63 R4.2 | 18.96,21.97 C2.2
VAUX
  Top 0.305: U2.1 13.1,25.13 12.83,25.4 12.83,26.76 C4.1
VCC
  Top 0.203: R2.1 23.28,19.6
  Top 0.254: 4.2,17.27 J1.1
  pour Top: 23.62,18.29 7.11,18.29 5.71,16.89 3.43,16.89 3.43,17.4 5.33,17.4 7.11,20.19 13.08,20.19 13.08,23.24 13.87,23.24 13.87,20.19 23.62,20.19
VDDA
  Top 0.203: U1.13 34.37,10.45 C17.1 33.02,9.11 33.02,4.87 R16.1 L3.1
VREF_OUT
  Top 0.203: 37.88,11.64 C16.1 36.58,13.17 36.58,13.97 36.73,14.12 U1.17
VREFH
  Top 0.203: U1.14 34.87,8.41 C11.1 35.77,5.92 R16.2
VREFL
  Top 0.203: U1.15 U1.16 35.87,10.25 C17.2 37.88,10.16 C16.2 L4.2 37.2,7.62 C11.2

### Text on the board
tPlace: U2 | appfruits.com | Phillip Schuster | Made in / Hamburg, Germany | Custom Teensy 3.1 / Example Board
tDocu: IMPORTANT: This specific board layout is just an example, it has never been / produced and tested (which would not make sense as all it is able to do is / controlling a LED ;-)). I created it by ripping out all project specific components / from a real working board I recently created and tested with OSHPark. / Use it as a reference for your own board. It's very important to get the correct / differential pairs impedance for the USB-pairs. In this example the OSHParks / 4-Layer-Stackup and dielectric constant of 3.66 (OSHParks FR408) is used as a / base for the calculation. | This is a 4-Layer board. If you own the EAGLE free edition you will not be able / to use/see all necessary layers. EAGLEs hobbyist license will do the trick. / Layer stack is: Top, GND, 3.3V, Bottom. | There are quite few DRC errors (when using OSHParks 4-Layer DRU file) which / are quite EAGLE specific or can not be prevented (like USBs clearance warning / on MCU pins). My real board based on exactely this component layout and errors / works flawlessly. | I have written a comprehensive blog post on how to build a custom Teensy 3.1. / You should read that before creating your own board: / http://www.appfruits.com/2015/03/building-your-own-custom-teensy/ | Have fun and good luck, / Phillip | Released under the Creative Commons Attribution Share-Alike 4.0 License / https://creativecommons.org/licenses/by-sa/4.0/
BlindViaText: V:3.3V:11:90 | V:3.3V:5:90 | V:3.3V:6:90 | V:GND:24:90 | V:GND:38:90 | V:GND:41:90 | V:GND:55:90 | V:GND:56:90 | V:3.3V:12:90 | V:3.3V:1:90 | V:3.3V:7:90 | FillOverPAD:3.3V:5:208 | FillOverPAD:PGND:6:208 | V:GND:37:90 | V:GND:25:90 | FillOverPAD:GND:60:208 | V:GND:57:90 | V:GND:61:90 | V:GND:60:90 | V:GND:59:90 | V:GND:58:90 | V:3.3V:13:90 | V:3.3V:2:90 | V:3.3V:8:90 | V:GND:39:90 | V:GND:36:90 | V:GND:40:90 | FillOverPAD:GND:70:208 | V:3.3V:14:90 | V:3.3V:3:90 | V:3.3V:9:90 | FillOverPAD:PGND:8:208 | V:GND:35:90 | V:GND:26:90 | V:GND:50:90 | V:GND:65:90 | V:GND:63:90 | V:3.3V:4:90 | V:3.3V:10:90 | FillOverPAD:PGND:151:208 | FillOverPAD:PGND:150:208 | V:GND:42:90 | FillOverPAD:GND:10:208 | FillOverPAD:GND:65:208 | FillOverPAD:3.3V:49:208 | FillOverPAD:3.3V:141:208 | V:GND:22:90 | V:GND:20:90 | FillOverPAD:PGND:148:208 | FillOverPAD:3.3V:63:208 | FillOverPAD:3.3V:9:208 | FillOverPAD:PGND:143:208 | V:GND:21:90 | FillOverPAD:PGND:154:208 | V:GND:23:90 | V:GND:19:90 | FillOverPAD:3.3V:123:208 | FillOverPAD:GND:122:208 | FillOverPAD:GND:52:208 | V:GND:62:90 | FillOverPAD:VCC:144:208 | FillOverPAD:PGND:153:208 | FillOverPAD:PGND:152:208 | FillOverPAD:GND:58:208 | FillOverPAD:USB_SHIELD:43:208 | FillOverPAD:GND:42:208 | V:GND:54:90 | V:GND:15:90 | V:GND:18:90 | V:GND:64:90 | FillOverPAD:PGND:2:208 | FillOverPAD:3.3V:105:208 | FillOverPAD:GND:106:208 | FillOverPAD:3.3V:19:208 | FillOverPAD:GND:20:208 | FillOverPAD:USB_SHIELD:36:208 | FillOverPAD:VCC:41:208 | FillOverPAD:VCC:1:208 | FillOverPAD:VCC:67:208 | FillOverPAD:VCC:3:208 | FillOverPAD:VCC:57:208 | FillOverPAD:VCC:54:208 | FillOverPAD:USB_SHIELD:38:208 | V:GND:32:90 | FillOverPAD:GND:179:208 | V:GND:53:90 | V:GND:16:90 | FillOverPAD:VCC:29:208 | FillOverPAD:3.3V:96:208 | FillOverPAD:3.3V:25:208 | FillOverPAD:GND:26:208 | V:GND:17:90 | FillOverPAD:GND:33:208 | FillOverPAD:3.3V:196:208 | FillOverPAD:3.3V:197:208 | FillOverPAD:3.3V:27:208 | V:GND:30:90 | V:GND:31:90 | FillOverPAD:GND:171:208 | FillOverPAD:USB_SHIELD:39:208 | V:GND:46:90 | FillOverPAD:GND:28:208 | FillOverPAD:GND:201:208 | FillOverPAD:USB_SHIELD:37:208 | V:GND:88:90 | V:GND:84:90 | V:GND:82:90 | V:GND:83:90 | FillOverPAD:3.3V:78:208 | FillOverPAD:GND:79:208 | FillOverPAD:3.3V:82:208 | FillOverPAD:3.3V:83:208 | V:GND:49:90 | FillOverPAD:GND:14:208 | V:GND:52:90 | FillOverPAD:3.3V:21:208 | FillOverPAD:3.3V:23:208 | V:GND:45:90 | V:GND:47:90 | FillOverPAD:GND:159:208 | V:GND:33:90 | V:GND:48:90 | V:GND:29:90 | FillOverPAD:GND:22:208 | FillOverPAD:GND:24:208 | V:GND:44:90 | FillOverPAD:GND:46:208 | V:GND:90:90 | V:GND:34:90 | V:GND:85:90 | V:GND:81:90 | V:GND:78:90 | V:GND:77:90 | V:GND:27:90 | V:GND:28:90 | V:GND:72:90 | V:GND:71:90 | V:GND:68:90 | V:GND:67:90 | V:GND:51:90 | V:GND:43:90 | FillOverPAD:3.3V:45:208 | V:GND:89:90 | V:GND:87:90 | V:GND:86:90 | V:GND:80:90 | V:GND:79:90 | V:GND:76:90 | V:GND:75:90 | V:GND:74:90 | V:GND:73:90 | V:GND:70:90 | V:GND:69:90 | V:GND:66:90